# Altium project PCB_Project_Power.PrjPcb (part 1 of 2)
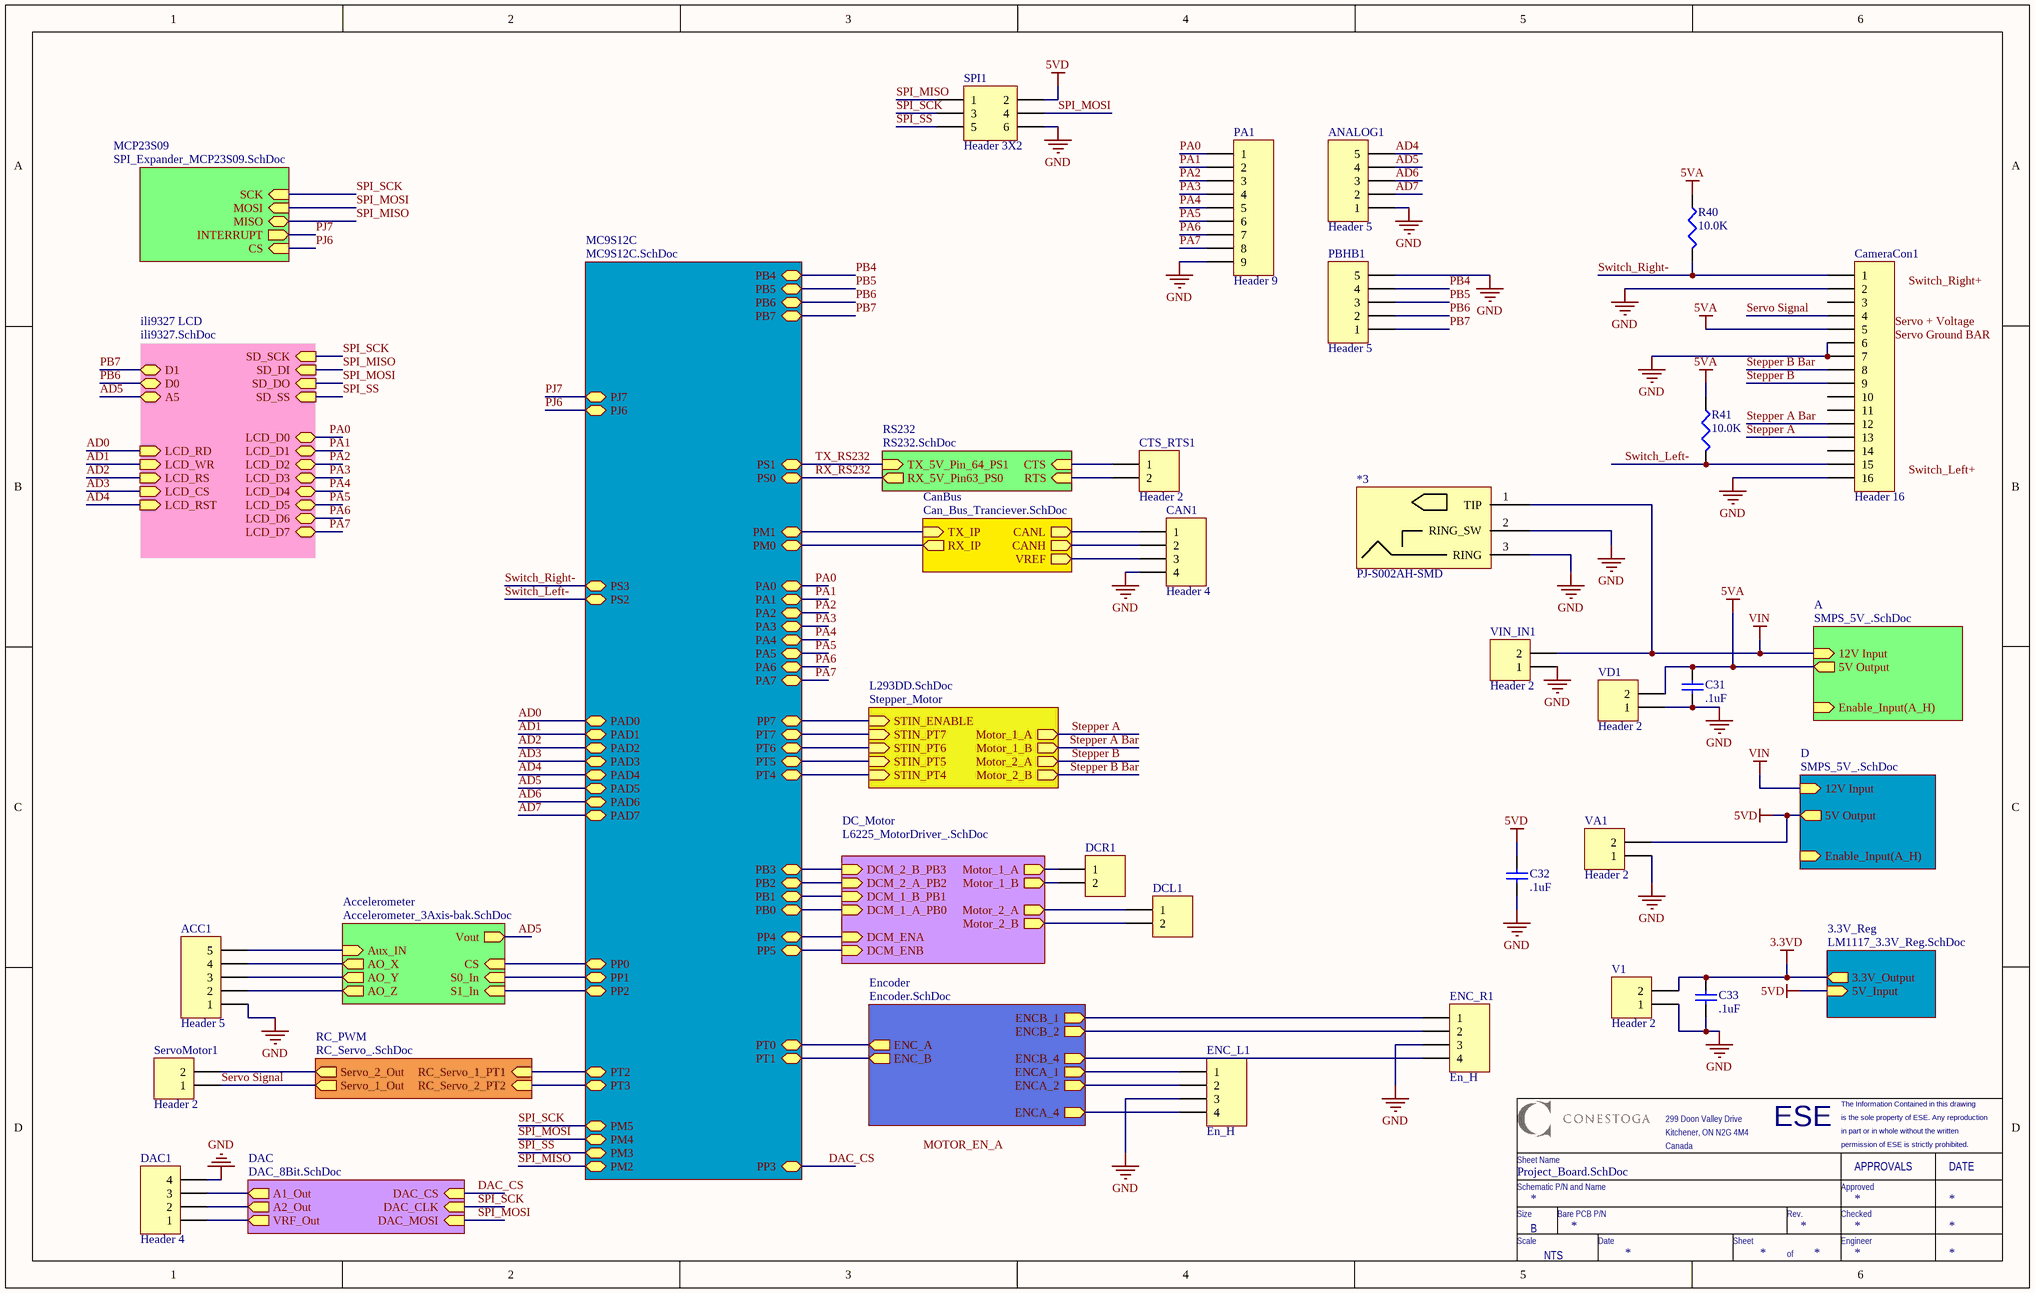
[diagram p0: Project_Board.SchDoc]
15 sheets, 188 parts. Net scope: hierarchical (ports join the sheet entries above them; power ports are global).
Board files: Final_Fantasy.PcbDoc, PCB1.PcbDoc, PCB2.PcbDoc
Sheets:
  Project_Board.SchDoc
    RS232 = RS232.SchDoc
    A = SMPS_5V_.SchDoc
    D = SMPS_5V_.SchDoc
    3.3V_Reg = LM1117_3.3V_Reg.SchDoc
    CanBus = Can_Bus_Tranciever.SchDoc
    DC_Motor = L6225_MotorDriver_.SchDoc
    Stepper_Motor = L293DD.SchDoc
    RC_PWM = RC_Servo_.SchDoc
    Accelerometer = Accelerometer_3Axis-bak.SchDoc
    DAC = DAC_8Bit.SchDoc
    ili9327 LCD = ili9327.SchDoc
    MC9S12C = MC9S12C.SchDoc
    Encoder = Encoder.SchDoc
    MCP23S09 = SPI_Expander_MCP23S09.SchDoc
  PSU.SchDoc

## Sheet Project_Board.SchDoc
size B

### Parts
*3  PJ-S002AH-SMD  [PJ-002AH-SMD]
ACC1  Header 5  [HDR1X5]
ANALOG1  Header 5  [HDR1X5]
C31  value .1uF  [CAPC2012X09M]  (hidden comment: Cap)
C32  value .1uF  [CAPC2012X09M]  (hidden comment: Cap)
C33  value .1uF  [CAPC2012X09M]  (hidden comment: Cap)
CameraCon1  Header 16  [HDR1X16]
CAN1  Header 4  [HDR1X4]
CTS_RTS1  Header 2  [HDR1X2]
DAC1  Header 4  [HDR1X4]
DCL1  Header 2  [HDR1X2]  (value not drawn)
DCR1  Header 2  [HDR1X2]  (value not drawn)
ENC_L1  En_H  [HDR1X4]
ENC_R1  En_H  [HDR1X4]
PA1  Header 9  [HDR1X9]
PBHB1  Header 5  [HDR1X5]
R40  value 10.0K  [RESC2112X05M]  (hidden comment: Res3)
R41  value 10.0K  [RESC2112X05M]  (hidden comment: Res3)
ServoMotor1  Header 2  [HDR1X2]
SPI1  Header 3X2  [HDR2X3]
V1  Header 2  [HDR1X2]
VA1  Header 2  [HDR1X2]
VD1  Header 2  [HDR1X2]
VIN_IN1  Header 2  [HDR1X2]

### Sub-sheets
3.3V_Reg = LM1117_3.3V_Reg.SchDoc: 3.3V_Output (out), 5V_Input (in)
A = SMPS_5V_.SchDoc: 5V Output (out), 12V Input (in), Enable_Input(A_H) (in)
Accelerometer = Accelerometer_3Axis-bak.SchDoc: AO_X (out), AO_Y (out), AO_Z (out), Aux_IN (in), S1_In (in), S0_In (in), CS (in), Vout (out)
CanBus = Can_Bus_Tranciever.SchDoc: TX_IP (in), CANH (out), CANL (out), RX_IP (out), VREF (out)
D = SMPS_5V_.SchDoc: 5V Output (out), 12V Input (in), Enable_Input(A_H) (in)
DAC = DAC_8Bit.SchDoc: A1_Out (out), A2_Out (out), VRF_Out (out), DAC_CS (in), DAC_CLK (in), DAC_MOSI (in)
DC_Motor = L6225_MotorDriver_.SchDoc: Motor_1_A (out), Motor_1_B (out), Motor_2_A (out), Motor_2_B (out), DCM_2_B_PB3 (in), DCM_2_A_PB2 (in), DCM_1_B_PB1 (in), DCM_1_A_PB0 (in), DCM_ENA (in), DCM_ENB (in)
Encoder = Encoder.SchDoc: ENCB_1 (out), ENCB_2 (out), ENCB_4 (out), ENCA_1 (out), ENCA_2 (out), ENCA_4 (out), ENC_A (out), ENC_B (out)
ili9327 LCD = ili9327.SchDoc: SD_SS (in), SD_DI (in), SD_DO (in), SD_SCK (in), LCD_RST (in), LCD_RD (in), LCD_WR (in), LCD_RS (in), LCD_CS (in), LCD_D2, LCD_D3, LCD_D4, LCD_D5, LCD_D6, LCD_D7, LCD_D0, LCD_D1, D1, D0, A5
MC9S12C = MC9S12C.SchDoc: PA0, PA1, PA2, PA3, PA4, PA5, PA6, PA7, PAD0, PAD1, PAD2, PAD3, PAD4, PAD5, PAD6, PAD7, PT0, PT1, PT2, PT3, PT4, PT5, PT6, PT7, PB0, PB1, PB2, PB3, PB4, PB5, PB6, PB7, PM0, PM1, PM2, PM3, PM4, PM5, PS0, PS1, PS2, PS3, PP0, PP1, PP2, PP3, PP4, PP5, PP7, PJ6, PJ7
MCP23S09 = SPI_Expander_MCP23S09.SchDoc: INTERRUPT (out), SCK (in), MOSI (in), MISO, CS (in)
RC_PWM = RC_Servo_.SchDoc: RC_Servo_2_PT2 (in), Servo_2_Out (out), Servo_1_Out (out), RC_Servo_1_PT1 (in)
RS232 = RS232.SchDoc: RTS (in), CTS (in), TX_5V_Pin_64_PS1 (in), RX_5V_Pin63_PS0 (out)
Stepper_Motor = L293DD.SchDoc: STIN_PT4 (in), STIN_PT5 (in), STIN_PT6 (in), STIN_PT7 (in), Motor_1_A (out), Motor_1_B (out), Motor_2_A (out), Motor_2_B (out), STIN_ENABLE (in)

### Nets
3.3VD: C33.2 V1.2 ; sheet 3.3V_Reg/3.3V_Output
5VA: C31.2 CameraCon1.5 R40.1 R41.1 VD1.2 ; sheet A/5V Output
5VD: C32.2 SPI1.2 VA1.2 ; sheet D/5V Output, sheet 3.3V_Reg/5V_Input
GND: *3.2(RING_SW) *3.3(RING) ACC1.1 ANALOG1.1 C31.1 C32.1 C33.1 CameraCon1.2 CameraCon1.6 CameraCon1.7 CameraCon1.16 CAN1.4 DAC1.4 ENC_L1.3 ENC_R1.3 PA1.9 PBHB1.5 SPI1.6 V1.1 VA1.1 VD1.1 VIN_IN1.1
VIN: *3.1(TIP) VIN_IN1.2 ; sheet A/12V Input, sheet D/12V Input
AD0: sheet ili9327 LCD/LCD_RD, sheet MC9S12C/PAD0
AD1: sheet ili9327 LCD/LCD_WR, sheet MC9S12C/PAD1
AD2: sheet ili9327 LCD/LCD_RS, sheet MC9S12C/PAD2
AD3: sheet ili9327 LCD/LCD_CS, sheet MC9S12C/PAD3
AD4: ANALOG1.5 ; sheet ili9327 LCD/LCD_RST, sheet MC9S12C/PAD4
AD5: ANALOG1.4 ; sheet Accelerometer/Vout, sheet ili9327 LCD/A5, sheet MC9S12C/PAD5
AD6: ANALOG1.3 ; sheet MC9S12C/PAD6
AD7: ANALOG1.2 ; sheet MC9S12C/PAD7
DAC_CS: sheet DAC/DAC_CS, sheet MC9S12C/PP3
PA0: PA1.1 ; sheet ili9327 LCD/LCD_D0, sheet MC9S12C/PA0
PA1: PA1.2 ; sheet ili9327 LCD/LCD_D1, sheet MC9S12C/PA1
PA2: PA1.3 ; sheet ili9327 LCD/LCD_D2, sheet MC9S12C/PA2
PA3: PA1.4 ; sheet ili9327 LCD/LCD_D3, sheet MC9S12C/PA3
PA4: PA1.5 ; sheet ili9327 LCD/LCD_D4, sheet MC9S12C/PA4
PA5: PA1.6 ; sheet ili9327 LCD/LCD_D5, sheet MC9S12C/PA5
PA6: PA1.7 ; sheet ili9327 LCD/LCD_D6, sheet MC9S12C/PA6
PA7: PA1.8 ; sheet ili9327 LCD/LCD_D7, sheet MC9S12C/PA7
PB4: PBHB1.4 ; sheet MC9S12C/PB4
PB5: PBHB1.3 ; sheet MC9S12C/PB5
PB6: PBHB1.2 ; sheet ili9327 LCD/D0, sheet MC9S12C/PB6
PB7: PBHB1.1 ; sheet ili9327 LCD/D1, sheet MC9S12C/PB7
PJ6: sheet MC9S12C/PJ6, sheet MCP23S09/CS
PJ7: sheet MC9S12C/PJ7, sheet MCP23S09/INTERRUPT
RX_RS232: sheet RS232/RX_5V_Pin63_PS0, sheet MC9S12C/PS0
Servo Signal: CameraCon1.4 ServoMotor1.1 ; sheet RC_PWM/Servo_1_Out
SPI_MISO: SPI1.1 ; sheet ili9327 LCD/SD_DI, sheet MC9S12C/PM2, sheet MCP23S09/MISO
SPI_MOSI: SPI1.4 ; sheet DAC/DAC_MOSI, sheet ili9327 LCD/SD_DO, sheet MC9S12C/PM4, sheet MCP23S09/MOSI
SPI_SCK: SPI1.3 ; sheet DAC/DAC_CLK, sheet ili9327 LCD/SD_SCK, sheet MC9S12C/PM5, sheet MCP23S09/SCK
SPI_SS: SPI1.5 ; sheet ili9327 LCD/SD_SS, sheet MC9S12C/PM3
Stepper A: CameraCon1.13 ; sheet Stepper_Motor/Motor_1_A
Stepper A Bar: CameraCon1.12 ; sheet Stepper_Motor/Motor_1_B
Stepper B: CameraCon1.9 ; sheet Stepper_Motor/Motor_2_A
Stepper B Bar: CameraCon1.8 ; sheet Stepper_Motor/Motor_2_B
Switch_Left-: CameraCon1.15 R41.2 ; sheet MC9S12C/PS2
Switch_Right-: CameraCon1.1 R40.2 ; sheet MC9S12C/PS3
TX_RS232: sheet RS232/TX_5V_Pin_64_PS1, sheet MC9S12C/PS1
NetACC1_2: ACC1.2 ; sheet Accelerometer/AO_Z
NetACC1_3: ACC1.3 ; sheet Accelerometer/AO_Y
NetACC1_4: ACC1.4 ; sheet Accelerometer/AO_X
NetACC1_5: ACC1.5 ; sheet Accelerometer/Aux_IN
NetC48_2: ENC_L1.1 ; sheet Encoder/ENCA_1
NetC49_2: ENC_R1.1 ; sheet Encoder/ENCB_1
NetC50_1: ENC_L1.4 ; sheet Encoder/ENCA_4
NetC51_1: ENC_R1.4 ; sheet Encoder/ENCB_4
NetCAN1_1: CAN1.1 ; sheet CanBus/CANL
NetCAN1_2: CAN1.2 ; sheet CanBus/CANH
NetCAN1_3: CAN1.3 ; sheet CanBus/VREF
NetCan_Bus1_1: sheet CanBus/TX_IP, sheet MC9S12C/PM1
NetCan_Bus1_4: sheet CanBus/RX_IP, sheet MC9S12C/PM0
NetCTS_RTS1_1: CTS_RTS1.1 ; sheet RS232/CTS
NetCTS_RTS1_2: CTS_RTS1.2 ; sheet RS232/RTS
NetDAC1_1: DAC1.1 ; sheet DAC/VRF_Out
NetDAC1_2: DAC1.2 ; sheet DAC/A2_Out
NetDAC1_3: DAC1.3 ; sheet DAC/A1_Out
NetDCL1_1: DCL1.1 ; sheet DC_Motor/Motor_2_A
NetDCL1_2: DCL1.2 ; sheet DC_Motor/Motor_2_B
NetDCR1_1: DCR1.1 ; sheet DC_Motor/Motor_1_A
NetDCR1_2: DCR1.2 ; sheet DC_Motor/Motor_1_B
NetENC_L1_2: ENC_L1.2 ; sheet Encoder/ENCA_2
NetENC_R1_2: ENC_R1.2 ; sheet Encoder/ENCB_2
NetFreescale_Processor1_2: sheet Accelerometer/S1_In, sheet MC9S12C/PP2
NetFreescale_Processor1_3: sheet Accelerometer/S0_In, sheet MC9S12C/PP1
NetFreescale_Processor1_4: sheet Accelerometer/CS, sheet MC9S12C/PP0
NetFreescale_Processor1_5: sheet MC9S12C/PT0, sheet Encoder/ENC_A
NetFreescale_Processor1_6: sheet MC9S12C/PT1, sheet Encoder/ENC_B
NetFreescale_Processor1_7: sheet RC_PWM/RC_Servo_1_PT1, sheet MC9S12C/PT2
NetFreescale_Processor1_8: sheet RC_PWM/RC_Servo_2_PT2, sheet MC9S12C/PT3
NetFreescale_Processor1_11: sheet Stepper_Motor/STIN_PT4, sheet MC9S12C/PT4
NetFreescale_Processor1_12: sheet Stepper_Motor/STIN_PT5, sheet MC9S12C/PT5
NetFreescale_Processor1_13: sheet Stepper_Motor/STIN_PT6, sheet MC9S12C/PT6
NetFreescale_Processor1_14: sheet Stepper_Motor/STIN_PT7, sheet MC9S12C/PT7
NetFreescale_Processor1_16: sheet DC_Motor/DCM_1_A_PB0, sheet MC9S12C/PB0
NetFreescale_Processor1_17: sheet DC_Motor/DCM_1_B_PB1, sheet MC9S12C/PB1
NetFreescale_Processor1_18: sheet DC_Motor/DCM_2_A_PB2, sheet MC9S12C/PB2
NetFreescale_Processor1_19: sheet DC_Motor/DCM_2_B_PB3, sheet MC9S12C/PB3
NetFreescale_Processor1_78: sheet Stepper_Motor/STIN_ENABLE, sheet MC9S12C/PP7
NetFreescale_Processor1_79: sheet DC_Motor/DCM_ENB, sheet MC9S12C/PP5
NetFreescale_Processor1_80: sheet DC_Motor/DCM_ENA, sheet MC9S12C/PP4
NetR50_2: ServoMotor1.2 ; sheet RC_PWM/Servo_2_Out

Not connected (* = marked no-connect by the designer): CameraCon1 3 10 11 14

### Notes on the sheet
- Labels drawn without touching a wire or pin: MOTOR_EN_A, Servo + Voltage, Servo Ground BAR, Switch_Left+, Switch_Right+
- ESE
- is the sole property of ESE. Any reproduction
- The Information Contained in this drawing
- Schematic P/N and Name
- Sheet Name
- 299 Doon Valley Drive
- Kitchener, ON N2G 4M4
- Canada
- Approved
- in part or in whole without the written
- permission of ESE is strictly prohibited.
- APPROVALS
- DATE
- Size
- Scale
- B
- NTS
- Bare PCB P/N
- Date
- Sheet
- Rev.
- Checked
- Engineer
- of

### Library data of the parts
ACC1 ANALOG1 PBHB1 = Header 5: Header, 5-Pin; LatestRevisionDate: 17-Jul-2002; LatestRevisionNote: Re-released for DXP Platform.; Publisher: Altium Limited
C31-C33 = CAP-Z5U-.1uF-50V-±20%: CAP CER .1uF 50v Z5U 0805; MPN: C0805C104M5UACTU; WV: 50; Tolerance: ±20%; PN: 399-1176-1-ND; Name: CAP-Z5U-.1uF-50V-±20%; Type: Z5U; URL: http://www.digikey.ca/product-detail/en/C0805C104M5UACTU/399-1176-1-ND
CameraCon1 = Header 16: Header, 16-Pin; LatestRevisionDate: 17-Jul-2002; LatestRevisionNote: Re-released for DXP Platform.; Publisher: Altium Limited
CAN1 DAC1 ENC_L1 ENC_R1 = Header 4: Header, 4-Pin; LatestRevisionDate: 17-Jul-2002; LatestRevisionNote: Re-released for DXP Platform.; Publisher: Altium Limited
CTS_RTS1 ServoMotor1 V1 VA1 VD1 VIN_IN1 = Header 2: Header, 2-Pin; PN: S1212E-02-ND; URL: http://www.digikey.ca/product-detail/en/PEC04SFAN/S1212E-02-ND
DCL1 DCR1 = Header 2: Header, 2-Pin; MPN: PEC02SFAN; PN: S1212E-02-ND; URL: http://www.digikey.ca/product-detail/en/PEC04SFAN/S1212E-02-ND
PA1 = Header 9: Header, 9-Pin; LatestRevisionDate: 17-Jul-2002; LatestRevisionNote: Re-released for DXP Platform.; Publisher: Altium Limited
R40 R41 = Resistor_10.0K: RES SMD 10.0K OHM 1% 1/8W 0805; MPN: CRCW080510K0FKEA; PN: 541-10.0KCCT-ND; Name: Resistor_10.0K; URL: http://www.digikey.ca/product-detail/en/CRCW080510K0FKEA/541-10.0KCCT-ND
SPI1 = Header 3X2: Header, 3-Pin, Dual row; LatestRevisionDate: 17-Jul-2002; LatestRevisionNote: Re-released for DXP Platform.; Publisher: Altium Limited
*3 = PJ-S002AH-SMD: URL: http://www.digikey.com/product-detail/en/PJ-002AH-SMT-TR/CP-002AHPJCT-ND/669692

## Sheet RS232.SchDoc
size B
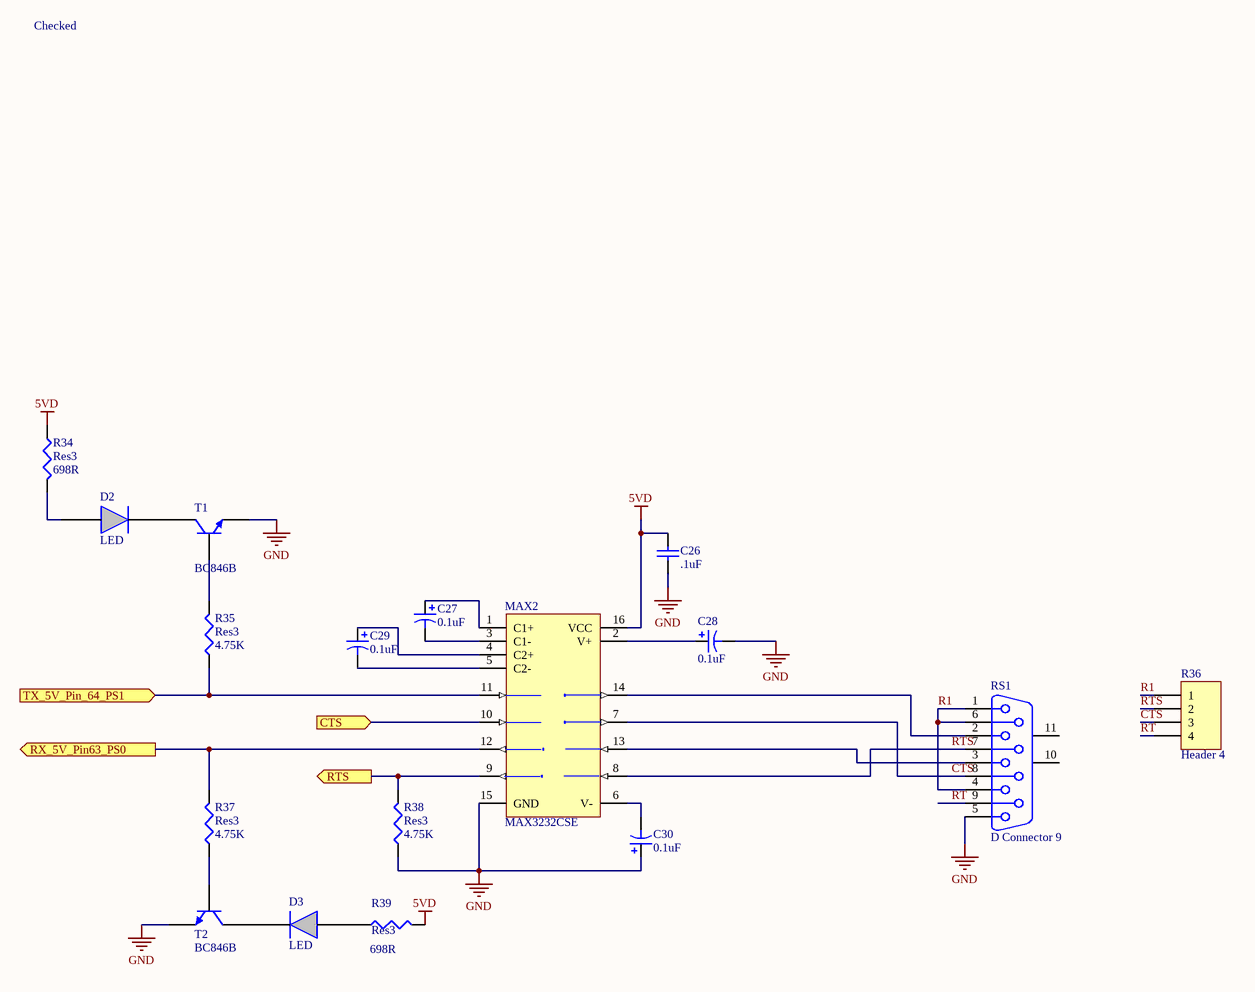
[diagram p1: RS232.SchDoc]

### Parts
C26  value .1uF  [CAPC2012X09M]  (hidden comment: Cap)
C27  value 0.1uF  [CAPACITOR_3MM]  (hidden comment: Pol)
C28  value 0.1uF  [CAPACITOR_3MM]  (hidden comment: Pol)
C29  value 0.1uF  [CAPACITOR_3MM]  (hidden comment: Pol)
C30  value 0.1uF  [CAPACITOR_3MM]  (hidden comment: Pol)
D2  LED  [LED]
D3  LED  [LED]
MAX2  MAX3232CSE  [NSO16_N]
R34  Res3  value 698R  [RESC2112X05M]
R35  Res3  value 4.75K  [RESC2112X05M]
R36  Header 4  [HDR1X4]
R37  Res3  value 4.75K  [RESC2112X05M]
R38  Res3  value 4.75K  [RESC2112X05M]
R39  Res3  value 698R  [RESC2112X05M]
RS1  D Connector 9  [DSUB1.385-2H9]
T1  BC846B  [SOT95P230X110-3M]
T2  BC846B  [SOT95P230X110-3M]

### Ports
CTS (in), RTS (out), RX_5V_Pin63_PS0 (out), TX_5V_Pin_64_PS1 (in)

### Nets
5VD: C26.1 MAX2.16(VCC) R34.1 R39.2
GND: C26.2 C28.2 C30.1 MAX2.15(GND) R38.1 RS1.5 T1.2(E) T2.2(E)
CTS: MAX2.7(T2OUT) R36.3 RS1.8
R1: R36.1 RS1.1 RS1.4 RS1.6
RT: R36.4 RS1.9
RTS: MAX2.8(R2IN) R36.2 RS1.7
RX_RS232: MAX2.12(R1OUT) R37.2 ; port RX_5V_Pin63_PS0
TX_RS232: MAX2.11(T1IN) R35.1 ; port TX_5V_Pin_64_PS1
NetC27_1: C27.1 MAX2.1(C1+)
NetC27_2: C27.2 MAX2.3(C1-)
NetC28_1: C28.1 MAX2.2(V+)
NetC29_1: C29.1 MAX2.4(C2+)
NetC29_2: C29.2 MAX2.5(C2-)
NetC30_2: C30.2 MAX2.6(V-)
NetCTS_RTS1_1: MAX2.10(T2IN) ; port CTS
NetCTS_RTS1_2: MAX2.9(R2OUT) R38.2 ; port RTS
NetD2_1: D2.1 T1.3(C)
NetD2_2: D2.2 R34.2
NetD3_1: D3.1 T2.3(C)
NetD3_2: D3.2 R39.1
NetMAX2_13: MAX2.13(R1IN) RS1.3
NetMAX2_14: MAX2.14(T1OUT) RS1.2
NetR35_2: R35.2 T1.1(B)
NetR37_1: R37.1 T2.1(B)

Not connected (* = marked no-connect by the designer): RS1 10(MH1) 11(MH2)

### Notes on the sheet
- Checked
- ESE
- is the sole property of ESE. Any reproduction
- The Information Contained in this drawing
- Schematic P/N and Name
- Sheet Name
- 299 Doon Valley Drive
- Kitchener, ON N2G 4M4
- Canada
- Approved
- in part or in whole without the written
- permission of ESE is strictly prohibited.
- APPROVALS
- DATE
- Size
- Scale
- B
- NTS
- Bare PCB P/N
- Date
- Sheet
- Rev.
- Engineer
- of

### Library data of the parts
C26 = CAP-X7R-.1uF-50V-±20%: CAP CER .1uF 50v X7R 0805; MPN: C0805C104M5RACTU; WV: 50; Tolerance: ±20%; PN: 399-1169-1-ND; Name: CAP-X7R-.1uF-50V-±20%; Type: X7R; URL: http://www.digikey.ca/product-detail/en/C0805C104M5RACTU/399-1169-1-ND
C27-C30 = Cap Polar-0.1uF-50V: CAP 85C 0.1uF ±20% 50V WX Series Aluminum Electrolytic; MPN: UWX1H0R1MCL2GB; Tan Theta: 0.12; Leakage Current: 3; Rated Ripple Current: 1; PN: 493-2121-1-ND; Name: Cap Polar-0.1uF-50V; Diameter: 3; URL: http://www.digikey.ca/product-detail/en/UWX1H0R1MCL2GB/493-2121-1-ND
MAX2 = MAX3232CSE: 3.0V TO 5.5V, Low-Power, up to 1Mbps, True RS-232 Transceiver Using Four 0.1µF External Capacitor; PN: MAX3232CSE+-ND; Published: 16-Jan-2001; LatestRevisionDate: 13-Apr-2006; LatestRevisionNote: IPC-7351 Footprint Added.; DatasheetVersion: Mar-1999; PackageReference: NSO16; Publisher: Altium Limited; PackageDescription: 16-Pin Small Outline Integrated Circuit 1.27 mm Pitch; Code_JEDEC: MS-012-AC; Code_IPC: SOIC127P600-16; ComponentLink1Description: Manufacturer Link; ComponentLink1URL: http://www.maxim-ic.com/; ComponentLink2Description: Datasheet; ComponentLink2URL: http://pdfserv.maxim-ic.com/en/ds/MAX3222-MAX3241.pdf; URL: http://www.digikey.ca/product-detail/en/MAX3232CSE%2B/MAX3232CSE%2B-ND/947902
R34 R39 = Resistor_698R: RES SMD 698R OHM 1% 1/8W 0805; MPN: CRCW0805698RFKEA; PN: 541-698CCT-ND; Name: Resistor_698R; URL: http://www.digikey.ca/product-detail/en/CRCW0805698RFKEA/541-698CCT-ND
R35 R37 R38 = Resistor_4.75K: RES SMD 4.75K OHM 1% 1/8W 0805; MPN: CRCW08054K75FKEA; PN: 541-4750KCCT-ND; Name: Resistor_4.75K; URL: http://www.digikey.ca/product-detail/en/CRCW08054K75FKEA/541-4750KCCT-ND
R36 = Header 4: Header, 4-Pin Male; MPN: PEC04SFAN; PN: S1212E-04-ND; URL: http://www.digikey.ca/product-detail/en/PEC04SFAN/S1212E-04-ND
RS1 = D Connector 9: Receptacle Assembly, 9 Position, Right Angle; PN: AE10921-ND; URL: http://www.digikey.ca/product-detail/en/ADF09A-KG-TASB3-R/AE10921-ND/1241800
T1 T2 = BC846B: NPN General Purpose Amplifier; PN: 568-1632-1-ND; URL: http://www.digikey.ca/product-detail/en/BC846B,215/568-1632-1-ND/763459

## Sheet SMPS_5V_.SchDoc
size B
Used 2 times, as channels A, D. Parts and nets are listed once, with the designators drawn on the sheet.
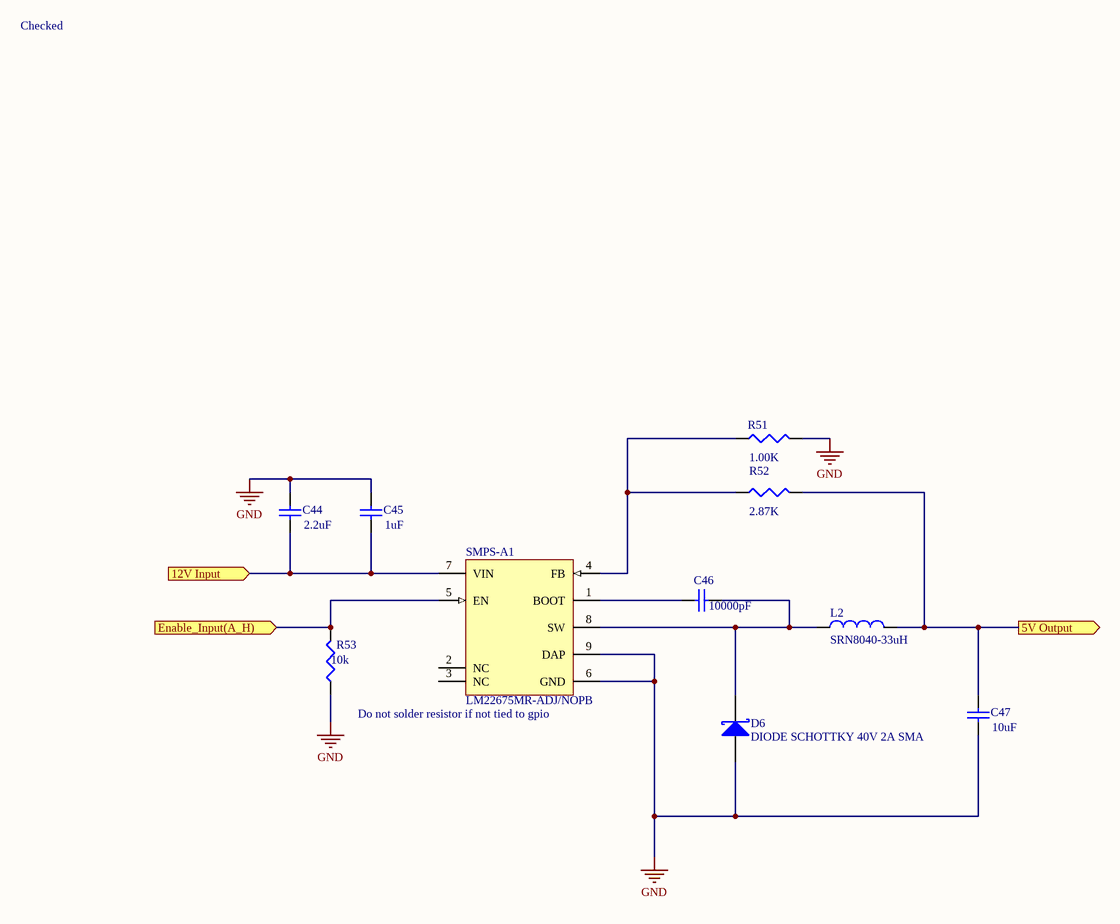
[diagram p2: SMPS_5V_.SchDoc]

### Parts
C44  value 2.2uF  [C1210]  (hidden comment: Cap-100V)
C45  value 1uF  [CAPC2012X09M]  (hidden comment: Cap)
C46  value 10000pF  [CAPC2012X09M]  (hidden comment: Cap)
C47  value 10uF  [C1210]  (hidden comment: Cap-10v-A)
D6  DIODE SCHOTTKY 40V 2A SMA  [DIOM4326X23M]
L2  SRN8040-33uH  [INDP8080X40M]
R51  value 1.00K  [RESC2112X05M]  (hidden comment: RFb1)
R52  value 2.87K  [RESC2112X05M]  (hidden comment: Res3)
R53  value 10k  [RESC2112X05M]  (hidden comment: Res3)
SMPS-A1  LM22675MR-ADJ/NOPB  [MRA08B_L]

### Ports
5V Output (out), 12V Input (in), Enable_Input(A_H) (in)

### Nets
GND: C44.2 C45.2 C47.1 D6.2(A) R51.2 R53.1 SMPS-A1.6(GND) SMPS-A1.9(DAP)
5V Output: C47.2 L2.2 R52.2 ; port 5V Output
12V Input: C44.1 C45.1 SMPS-A1.7(VIN) ; port 12V Input
Enable_Input(A_H): R53.2 SMPS-A1.5(EN) ; port Enable_Input(A_H)
NetC46_1: C46.1 D6.1(K) L2.1 SMPS-A1.8(SW)
NetC46_2: C46.2 SMPS-A1.1(BOOT)
NetR51_1: R51.1 R52.1 SMPS-A1.4(FB)

Not connected (* = marked no-connect by the designer): SMPS-A1 2(NC) 3(NC)

### Channels
A: designators end in _A; ports 5V Output=5VA 12V Input=VIN Enable_Input(A_H)=NetR53_A_2
D: designators end in _D; ports 5V Output=5VD 12V Input=VIN Enable_Input(A_H)=NetR53_D_2

### Notes on the sheet
- Checked
- Do not solder resistor if not tied to gpio
- ESE
- is the sole property of ESE. Any reproduction
- The Information Contained in this drawing
- Schematic P/N and Name
- Sheet Name
- 299 Doon Valley Drive
- Kitchener, ON N2G 4M4
- Canada
- Approved
- in part or in whole without the written
- permission of ESE is strictly prohibited.
- APPROVALS
- DATE
- Size
- Scale
- B
- NTS
- Bare PCB P/N
- Date
- Sheet
- Rev.
- Engineer
- of

### Library data of the parts
C44 C47 = Cap: Capacitor; Published: 8-Jun-2000; LatestRevisionDate: 17-Jul-2002; LatestRevisionNote: Re-released for DXP Platform.; PackageReference: RAD-0.3; Publisher: Altium Limited; PackageDescription: Radial Cap, Thru-Hole; 2 Leads; 0.3 in Pin Spacing
  C44: URL: http://www.digikey.ca/product-detail/en/HMK325B7225KN-T/587-1778-2-ND/1212778
C45 = CAP-X7R-1uF-16V-±10%: CAP CER 1uF 16v X7R 0805; MPN: C0805C105K4RACTU; WV: 16; Tolerance: ±10%; PN: 399-1284-1-ND; Name: CAP-X7R-1uF-16V-±10%; Type: X7R; URL: http://www.digikey.ca/product-detail/en/C0805C105K4RACTU/399-1284-1-ND
C46 = CAP-X7R-10000pF-100V-±10%: CAP CER 10000pF 100v X7R 0805; MPN: C0805C103K1RACTU; WV: 100; Tolerance: ±10%; PN: 399-1159-1-ND; Name: CAP-X7R-10000pF-100V-±10%; Type: X7R; URL: http://www.digikey.ca/product-detail/en/C0805C103K1RACTU/399-1159-1-ND
D6 = DIODE SCHOTTKY 40V 2A SMA: Schottky Rectifier; MPN: B240A-13-F; PN: B240A-FDICT-ND; URL: http://www.digikey.ca/product-detail/en/B240A-13-F/B240A-FDICT-ND
L2 = SRN8040: FIXED IND 22UH 2.2A 100 MOHM SMD; MPN: SRN8040-220M; PN: SRN8040-220MCT-ND; URL: http://www.digikey.ca/product-detail/en/SRN8040-330M/SRN8040-330MCT-ND/2756183
R51 = Resistor_1.00K: RES SMD 1.00K OHM 1% 1/8W 0805; MPN: CRCW08051K00FKEA; PN: 541-1000KCCT-ND; Name: Resistor_1.00K; URL: http://www.digikey.ca/product-detail/en/CRCW08051K00FKEA/541-1000KCCT-ND
R52 R53 = Resistor_2.87K: RES SMD 2.87K OHM 1% 1/8W 0805; MPN: CRCW08052K87FKEA; PN: 541-2870KCCT-ND; Name: Resistor_2.87K; URL: http://www.digikey.ca/product-detail/en/CRCW08052K87FKEA/541-2870KCCT-ND
SMPS-A1 = LM22675MR-ADJ/NOPB: 1A SIMPLE SWITCHER®, Step-Down Voltage Regulator with Precision Enable, 8-pin PSOP, Pb-Free; Manufacturer: National Semiconductor; MPN: LM22675MRE-ADJ/NOPB; PackageTopMarking: NSXYTT*L22675*ADJ; PowerWise: N; High-Reliability: Y; PN: LM22675MRE-ADJ/NOPBCT-ND; DatasheetVersion: Dec-2010; PackageVersion: revB, Dec-2007; PackageReference: MRA08B; PackageDescription: Molded, PSOP .193 x .154 x .058in, 8 Lead, .050in Pitch, Large DAP; PartNumber: LM22675MR-ADJ/NOPB; RoHS: Y; PinCount: 8; CompType: Switcher; Code_JEDEC: MS-012-AA; ComponentLink1Description: Manufacturer URL; ComponentLink1URL: http://www.national.com/; ComponentLink2Description: LM22675 Datasheet; ComponentLink2URL: http://www.national.com/ds/LM/LM22675.pdf; ComponentLink3Description: LM22675 Web Page; ComponentLink3URL: http://www.national.com/pf/LM/LM22675.html; ComponentLink4Description: MRA08B Package Page; ComponentLink4URL: http://www.national.com/packaging/folders/mra08b.html; URL: http://www.digikey.ca/product-detail/en/LM22675MRE-ADJ%2FNOPB/LM22675MRE-ADJ%2FNOPBCT-ND

## Sheet LM1117_3.3V_Reg.SchDoc
size B
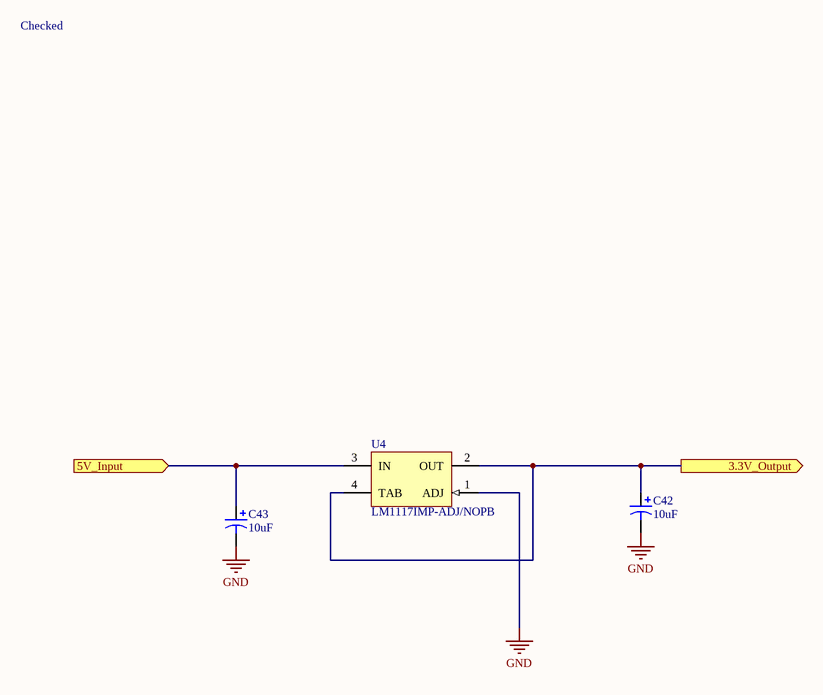
[diagram p3: LM1117_3.3V_Reg.SchDoc]

### Parts
C42  value 10uF  [CAPACITOR_3MM]  (hidden comment: Pol)
C43  value 10uF  [CAPACITOR_3MM]  (hidden comment: Pol)
U4  LM1117IMP-ADJ/NOPB  [MP04A_L]

### Ports
3.3V_Output (out), 5V_Input (in)

### Nets
3.3VD: C42.1 U4.2(OUT) U4.4(TAB) ; port 3.3V_Output
5VD: C43.1 U4.3(IN) ; port 5V_Input
GND: C42.2 C43.2 U4.1(ADJ)

### Notes on the sheet
- Checked
- ESE
- is the sole property of ESE. Any reproduction
- The Information Contained in this drawing
- Schematic P/N and Name
- Sheet Name
- 299 Doon Valley Drive
- Kitchener, ON N2G 4M4
- Canada
- Approved
- in part or in whole without the written
- permission of ESE is strictly prohibited.
- APPROVALS
- DATE
- Size
- Scale
- B
- NTS
- Bare PCB P/N
- Date
- Sheet
- Rev.
- Engineer
- of

### Library data of the parts
C42 C43 = Cap Polar-0.1uF-50V: as C27 on sheet RS232; Name: Cap Polar-0.1uF-50V; Diameter: 3; URL: http://www.digikey.ca/product-detail/en/UWX1C100MCL2GB/493-2099-2-ND/589840
U4 = LM1117IMP-ADJ/NOPB: 800mA Low-Dropout Linear Regulator, 4-pin SOT-223, Pb-Free; Manufacturer: National Semiconductor; MPN: LM1117MP-3.3/NOPB; PackageTopMarking: XYTT*N03B; PowerWise: N; CompType: LDO IC; PN: LM1117MP-3.3/NOPBCT-ND; Published: 1-Mar-2010; DatasheetVersion: Apr-2006; PackageVersion: revB, Apr-2003; PackageReference: MP04A; Publisher: Altium Limited; PackageDescription: Molded SOT-223, 6.50 x 3.56 x 1.6mm Body, 4 Lead, 2.3mm Pitch; Supplier 1: Digi-Key; Supplier Part Number 1: LM1117IMP-ADJTR-ND; Supplier 2: Digi-Key; Supplier Part Number 2: LM1117IMP-ADJCT-ND; Supplier 3: Digi-Key; Supplier Part Number 3: LM1117IMP-ADJDKR-ND; Supplier 4: Farnell; Supplier Part Number 4: 1469050; PartNumber: LM1117IMP-ADJ/NOPB; RoHS: Y; PinCount: 4; Code_JEDEC: TO-261-AA; Code_IPC: SOT223-4; ComponentLink1Description: LM1117 Datasheet; ComponentLink1URL: http://www.national.com/ds/LM/LM1117.pdf; ComponentLink2Description: LM1117 Web Page; ComponentLink2URL: http://www.national.com/pf/LM/LM1117.html; ComponentLink3Description: MP04A Package Page; ComponentLink3URL: http://www.national.com/packaging/folders/mp04a.html; URL: http://www.digikey.ca/product-detail/en/LM1117MP-3.3%2FNOPB/LM1117MP-3.3%2FNOPBCT-ND

## Sheet Can_Bus_Tranciever.SchDoc
size B
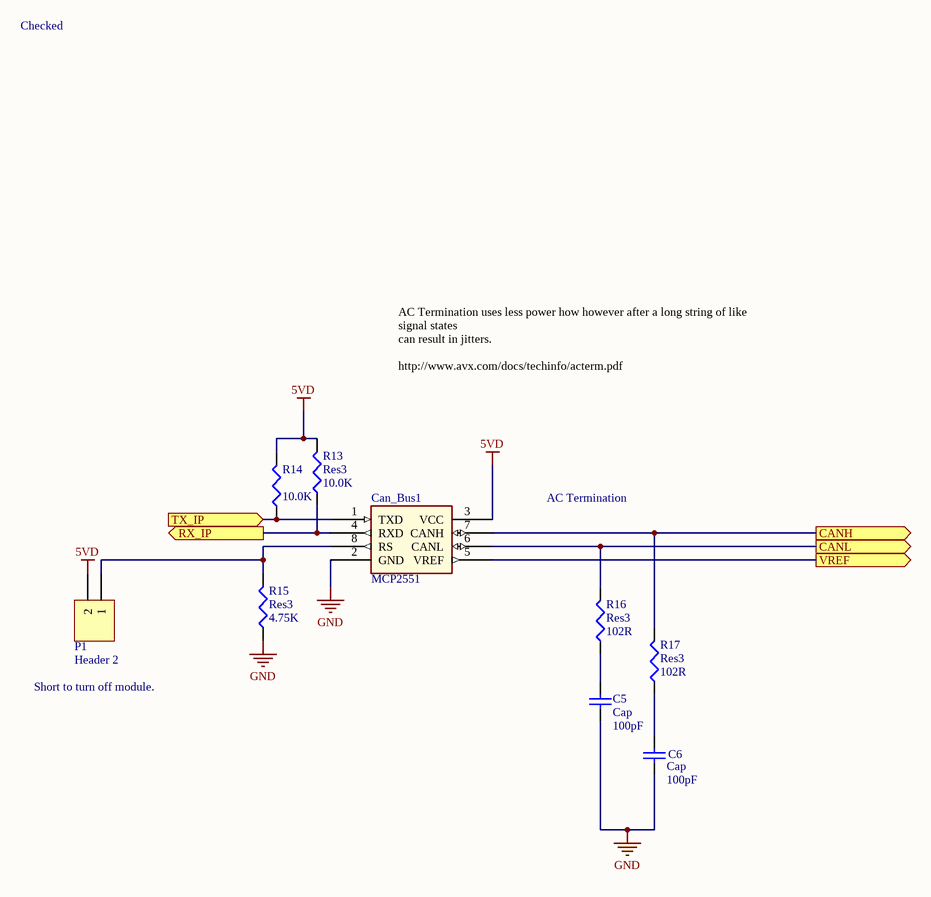
[diagram p4: Can_Bus_Tranciever.SchDoc]

### Parts
C5  Cap  value 100pF  [CAPC2012X09M]
C6  Cap  value 100pF  [CAPC2012X09M]
Can_Bus1  MCP2551  [SOIC127P600X175-8M]
P1  Header 2  [HDR1X2]
R13  Res3  value 10.0K  [RESC2112X05M]
R14  value 10.0K  [RESC2112X05M]  (hidden comment: Res3)
R15  Res3  value 4.75K  [RESC2112X05M]
R16  Res3  value 102R  [RESC2112X05M]
R17  Res3  value 102R  [RESC2112X05M]

### Ports
CANH (out), CANL (out), RX_IP (out), TX_IP (in), VREF (out)

### Nets
5VD: Can_Bus1.3(VCC) P1.2 R13.2 R14.2
GND: C5.1 C6.1 Can_Bus1.2(GND) R15.1
NetC5_2: C5.2 R16.1
NetC6_2: C6.2 R17.1
NetCAN1_1: Can_Bus1.6(CANL) R16.2 ; port CANL
NetCAN1_2: Can_Bus1.7(CANH) R17.2 ; port CANH
NetCAN1_3: Can_Bus1.5(VREF) ; port VREF
NetCan_Bus1_1: Can_Bus1.1(TXD) R14.1 ; port TX_IP
NetCan_Bus1_4: Can_Bus1.4(RXD) R13.1 ; port RX_IP
NetCan_Bus1_8: Can_Bus1.8(RS) P1.1 R15.2

### Notes on the sheet
- Checked
- AC Termination uses less power how however after a long string of like signal states
  can result in jitters.
  http://www.avx.com/docs/techinfo/acterm.pdf
- AC Termination
- Short to turn off module.
- ESE
- is the sole property of ESE. Any reproduction
- The Information Contained in this drawing
- Schematic P/N and Name
- Sheet Name
- 299 Doon Valley Drive
- Kitchener, ON N2G 4M4
- Canada
- Approved
- in part or in whole without the written
- permission of ESE is strictly prohibited.
- APPROVALS
- DATE
- Size
- Scale
- B
- NTS
- Bare PCB P/N
- Date
- Sheet
- Rev.
- Engineer
- of

### Library data of the parts
C5 C6 = CAP-COG-100pF-500V-±5%: CAP CER 100pF 500v COG 0805; MPN: C0805C101JCGACTU; PN: 399-5102-1-ND; Name: CAP-COG-100pF-500V-±5%; URL: http://www.digikey.ca/product-detail/en/C0805C101JCGACTU/399-5102-1-ND
Can_Bus1 = MCP2551: IC TRANSCEIVER CAN HI-SPD 8-SOIC; MPN: MCP2551T-E/SN; PN: MCP2551T-E/SNCT-ND; URL: http://ww1.microchip.com/downloads/en/DeviceDoc/21667f.pdf
P1 = Header 2: Header, 2-Pin Male; MPN: PEC02SFAN; PN: S1212E-02-ND; URL: http://www.digikey.ca/product-detail/en/PEC04SFAN/S1212E-02-ND
R13 R14 = Resistor_10.0K: as R40 on sheet Project_Board; Name: Resistor_10.0K; URL: http://www.digikey.ca/product-detail/en/CRCW080510K0FKEA/541-10.0KCCT-ND
R15 = Resistor_4.75K: RES SMD 4.75K OHM 1% 1/8W 0805; MPN: CRCW08054K75FKEA; PN: 541-4.75KCCT-ND; Name: Resistor_4.75K; URL: http://www.digikey.ca/product-detail/en/CRCW08054K75FKEA/541-4.75KCCT-ND
R16 R17 = Resistor_102R: RES SMD 102R OHM 1% 1/8W 0805; MPN: CRCW0805102RFKEA; PN: 541-102CCT-ND; Name: Resistor_102R; URL: http://www.digikey.ca/product-detail/en/CRCW0805102RFKEA/541-102CCT-ND

## Sheet L6225_MotorDriver_.SchDoc
size B
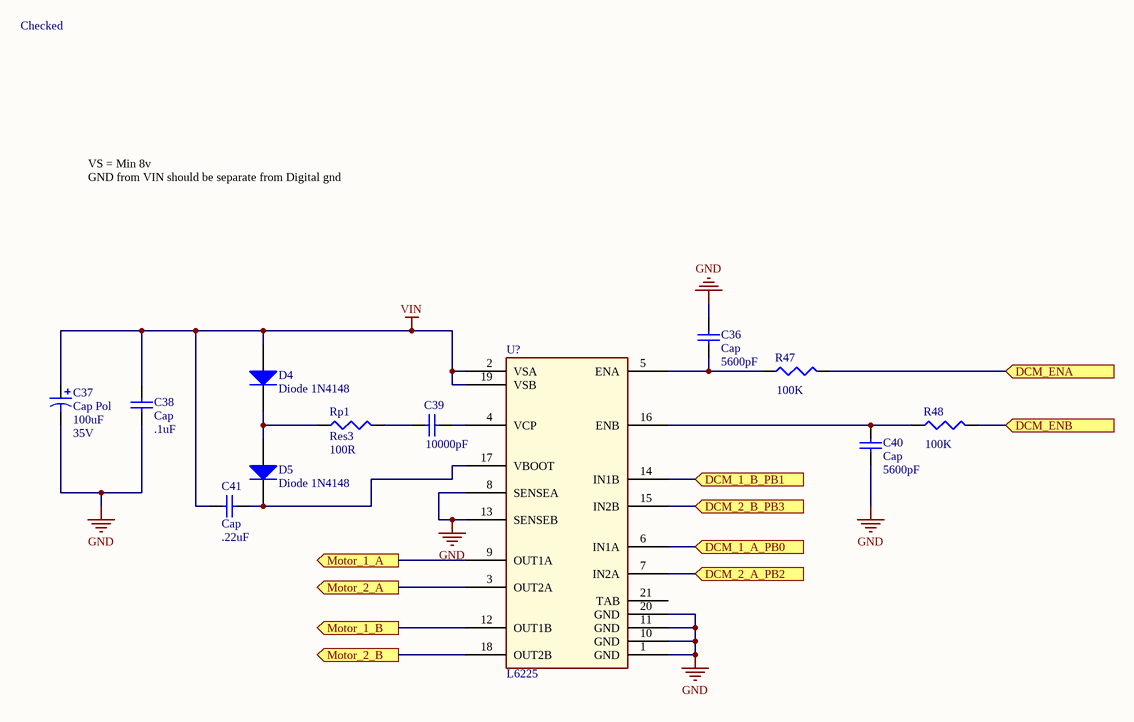
[diagram p5: L6225_MotorDriver_.SchDoc]

### Parts
C36  Cap  value 5600pF  [CAPC2012X09M]
C37  Cap Pol  value 100uF  Voltage: 35V  [CAPACITOR_6.3MM]
C38  Cap  value .1uF  [CAPC2012X09M]
C39  value 10000pF  [CAPC2012X09M]  (hidden comment: Cap)
C40  Cap  value 5600pF  [CAPC2012X09M]
C41  Cap  value .22uF  [CAPC2012X09M]
D4  Diode 1N4148  [zener_sod323]
D5  Diode 1N4148  [zener_sod323]
R47  value 100K  [RESC2112X05M]  (hidden comment: Res3)
R48  value 100K  [RESC2112X05M]  (hidden comment: Res3)
Rp1  Res3  value 100R  [RESC2112X05M]
U?  L6225  [POWERSOP20]

### Ports
DCM_1_A_PB0 (in), DCM_1_B_PB1 (in), DCM_2_A_PB2 (in), DCM_2_B_PB3 (in), DCM_ENA (in), DCM_ENB (in), Motor_1_A (out), Motor_1_B (out), Motor_2_A (out), Motor_2_B (out)

### Nets
GND: C36.2 C37.2 C38.1 C40.1 U?.1(GND) U?.8(SENSEA) U?.10(GND) U?.11(GND) U?.13(SENSEB) U?.20(GND)
VIN: C37.1 C38.2 C41.1 D4.A U?.2(VSA) U?.19(VSB)
NetC36_1: C36.1 R47.1 U?.5(ENA)
NetC39_1: C39.1 Rp1.2
NetC39_2: C39.2 U?.4(VCP)
NetC40_2: C40.2 R48.1 U?.16(ENB)
NetC41_2: C41.2 D5.K U?.17(VBOOT)
NetD4_K: D4.K D5.A Rp1.1
NetDCL1_1: U?.3(OUT2A) ; port Motor_2_A
NetDCL1_2: U?.18(OUT2B) ; port Motor_2_B
NetDCR1_1: U?.9(OUT1A) ; port Motor_1_A
NetDCR1_2: U?.12(OUT1B) ; port Motor_1_B
NetFreescale_Processor1_16: U?.6(IN1A) ; port DCM_1_A_PB0
NetFreescale_Processor1_17: U?.14(IN1B) ; port DCM_1_B_PB1
NetFreescale_Processor1_18: U?.7(IN2A) ; port DCM_2_A_PB2
NetFreescale_Processor1_19: U?.15(IN2B) ; port DCM_2_B_PB3
NetFreescale_Processor1_79: R48.2 ; port DCM_ENB
NetFreescale_Processor1_80: R47.2 ; port DCM_ENA

Not connected (* = marked no-connect by the designer): U? 21(TAB)

### Notes on the sheet
- Checked
- VS = Min 8v
  GND from VIN should be separate from Digital gnd
- ESE
- is the sole property of ESE. Any reproduction
- The Information Contained in this drawing
- Schematic P/N and Name
- Sheet Name
- 299 Doon Valley Drive
- Kitchener, ON N2G 4M4
- Canada
- Approved
- in part or in whole without the written
- permission of ESE is strictly prohibited.
- APPROVALS
- DATE
- Size
- Scale
- B
- NTS
- Bare PCB P/N
- Date
- Sheet
- Rev.
- Engineer
- of

### Library data of the parts
C36 C40 = CAP-X7R-5600pF-50V-±10%: CAP CER 5600pF 50v X7R 0805; MPN: C0805C562K5RACTU; PN: 399-1156-1-ND; Name: CAP-X7R-5600pF-50V-±10%; URL: http://www.digikey.ca/product-detail/en/C0805C562K5RACTU/399-1156-1-ND
C37 = Cap Polar-100uF-16V: CAP 85C 100uF ±20% 16V WX Series Aluminum Electrolytic; MPN: UWX1C101MCL1GB; Tan Theta: 0.16; Leakage Current: 16; Rated Ripple Current: 86; PN: 493-2105-1-ND; Name: Cap Polar-100uF-16V; Diameter: 6.3; URL: http://www.digikey.ca/product-detail/en/UWT1V101MCL1GS/493-2203-1-ND/590178
C38 = CAP-X7R-.1uF-100V-±10%: CAP CER .1uF 100v X7R 0805; MPN: C0805C104K1RACTU; PN: 399-3486-1-ND; Name: CAP-X7R-.1uF-100V-±10%; URL: http://www.digikey.ca/product-detail/en/C0805C104K1RACTU/399-3486-1-ND
C39 = CAP-X7R-10000pF-1000V-±5%: CAP CER 10000pF 1000v X7R 1210; MPN: C1210C103JDRACTU; PN: 399-5106-1-ND; Name: CAP-X7R-10000pF-1000V-±5%; URL: http://www.digikey.ca/product-detail/en/C1210C103JDRACTU/399-5106-1-ND
C41 = CAP-X7R-.22uF-50V-±10%: CAP CER .22uF 50v X7R 0805; MPN: C0805C224K5RACTU; PN: 399-3491-1-ND; Name: CAP-X7R-.22uF-50V-±10%; URL: http://www.digikey.ca/product-detail/en/C0805C224K5RACTU/399-3491-1-ND
D4 D5 = Diode 1N4148: High Conductance Fast Diode; PN: 1N4148WXTPMSCT-ND; URL: http://www.digikey.ca/product-detail/en/1N4148WX-TP/1N4148WXTPMSCT-ND/717312
R47 R48 = Resistor_100K: RES SMD 100K OHM 1% 1/8W 0805; MPN: CRCW0805100KFKEA; PN: 541-100KCCT-ND; Name: Resistor_100K; URL: http://www.digikey.ca/product-detail/en/CRCW0805100KFKEA/541-100KCCT-ND
Rp1 = Resistor_100R: RES SMD 100R OHM 1% 1/8W 0805; MPN: CRCW0805100RFKEA; PN: 541-100CCT-ND; Name: Resistor_100R; URL: http://www.digikey.ca/product-detail/en/CRCW0805100RFKEA/541-100CCT-ND
U? = L6225: IC MOTOR DRIVER PAR 20POWERSO; MPN: L6225PDTR; PN: 497-5345-1-ND; URL: http://www.digikey.ca/product-detail/en/L6225PDTR/497-5345-1-ND

## Sheet L293DD.SchDoc
size B
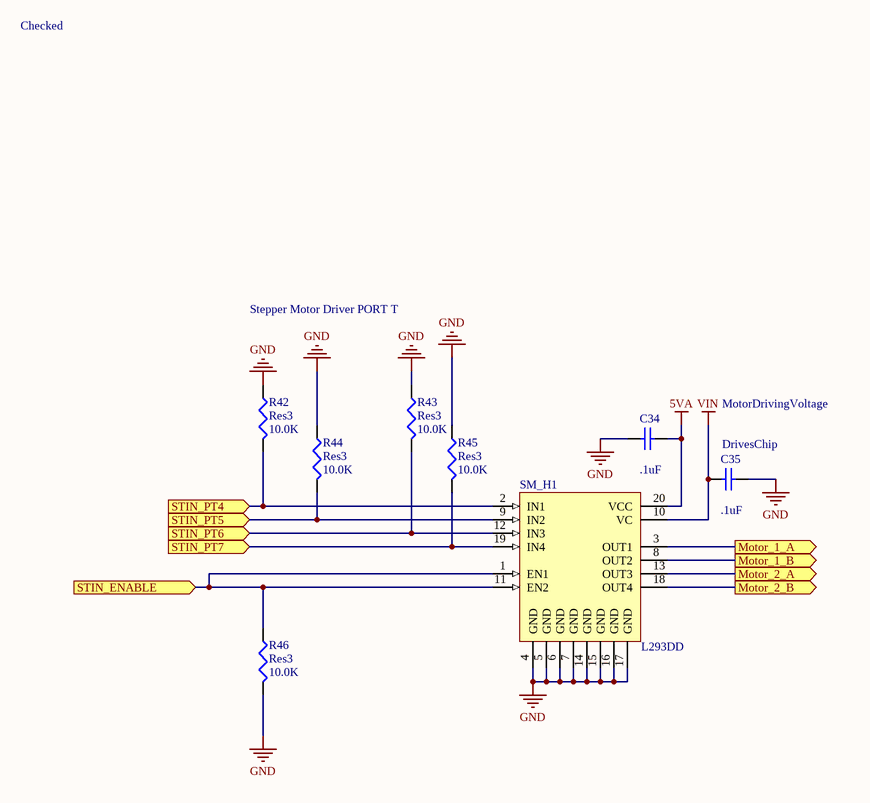
[diagram p6: L293DD.SchDoc]

### Parts
C34  value .1uF  [CAPC2012X09M]  (hidden comment: Cap)
C35  value .1uF  [CAPC2012X09M]  (hidden comment: Cap)
R42  Res3  value 10.0K  [RESC2112X05M]
R43  Res3  value 10.0K  [RESC2112X05M]
R44  Res3  value 10.0K  [RESC2112X05M]
R45  Res3  value 10.0K  [RESC2112X05M]
R46  Res3  value 10.0K  [RESC2112X05M]
SM_H1  L293DD  [SO20_N]

### Ports
Motor_1_A (out), Motor_1_B (out), Motor_2_A (out), Motor_2_B (out), STIN_ENABLE (in), STIN_PT4 (in), STIN_PT5 (in), STIN_PT6 (in), STIN_PT7 (in)

### Nets
5VA: C34.2 SM_H1.20(VCC)
GND: C34.1 C35.2 R42.1 R43.1 R44.1 R45.1 R46.2 SM_H1.4(GND) SM_H1.5(GND) SM_H1.6(GND) SM_H1.7(GND) SM_H1.14(GND) SM_H1.15(GND) SM_H1.16(GND) SM_H1.17(GND)
VIN: C35.1 SM_H1.10(VC)
Stepper A: SM_H1.3(OUT1) ; port Motor_1_A
Stepper A Bar: SM_H1.8(OUT2) ; port Motor_1_B
Stepper B: SM_H1.13(OUT3) ; port Motor_2_A
Stepper B Bar: SM_H1.18(OUT4) ; port Motor_2_B
NetFreescale_Processor1_11: R42.2 SM_H1.2(IN1) ; port STIN_PT4
NetFreescale_Processor1_12: R44.2 SM_H1.9(IN2) ; port STIN_PT5
NetFreescale_Processor1_13: R43.2 SM_H1.12(IN3) ; port STIN_PT6
NetFreescale_Processor1_14: R45.2 SM_H1.19(IN4) ; port STIN_PT7
NetFreescale_Processor1_78: R46.1 SM_H1.1(EN1) SM_H1.11(EN2) ; port STIN_ENABLE

### Notes on the sheet
- Checked
- Stepper Motor Driver PORT T
- MotorDrivingVoltage
- (near C35) DrivesChip
- ESE
- is the sole property of ESE. Any reproduction
- The Information Contained in this drawing
- Schematic P/N and Name
- Sheet Name
- 299 Doon Valley Drive
- Kitchener, ON N2G 4M4
- Canada
- Approved
- in part or in whole without the written
- permission of ESE is strictly prohibited.
- APPROVALS
- DATE
- Size
- Scale
- B
- NTS
- Bare PCB P/N
- Date
- Sheet
- Rev.
- Engineer
- of

### Library data of the parts
C34 C35 = CAP-X7R-.1uF-50V-±20%: as C26 on sheet RS232; Name: CAP-X7R-.1uF-50V-±20%; Type: X7R; URL: http://www.digikey.ca/product-detail/en/C0805C104M5RACTU/399-1169-1-ND
R42-R46 = Resistor_10.0K: as R40 on sheet Project_Board; Name: Resistor_10.0K; URL: http://www.digikey.ca/product-detail/en/CRCW080510K0FKEA/541-10.0KCCT-ND
SM_H1 = L293DD: Push-Pull Four Channel Driver With Diode; PN: 497-2937-1-ND; Published: 8-Jun-2000; LatestRevisionDate: 13-Apr-2006; LatestRevisionNote: IPC-7351 Footprint Added.; DatasheetVersion: Jun-1996; PackageVersion: Jul-2001; PackageReference: SO20; Publisher: Altium Limited; PackageDescription: 20-Pin Plastic Small Outline Integrated Circuit 1.27 mm Pitch; Code_JEDEC: MS-013-AC; Code_IPC: SOIC127P1030-20; ComponentLink1Description: Manufacturer Link; ComponentLink1URL: http://www.st.com/; ComponentLink2Description: Datasheet; ComponentLink2URL: http://www.st.com/stonline/products/literature/ds/1330/l293d.pdf; URL: http://www.digikey.ca/product-detail/en/L293DD013TR/497-2937-1-ND/634902

## Sheet RC_Servo_.SchDoc
size B
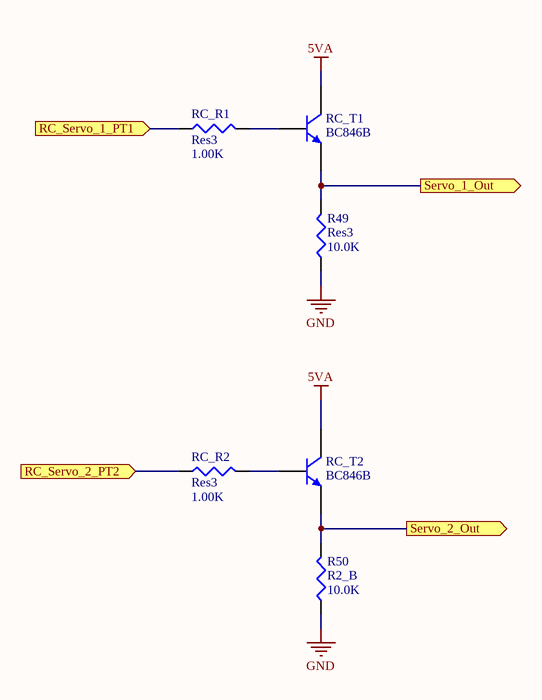
[diagram p7: RC_Servo_.SchDoc]

### Parts
R49  Res3  value 10.0K  [RESC2112X05M]
R50  R2_B  value 10.0K  [RESC2112X05M]
RC_R1  Res3  value 1.00K  [RESC2112X05M]
RC_R2  Res3  value 1.00K  [RESC2112X05M]
RC_T1  BC846B  [SOT95P230X110-3M]
RC_T2  BC846B  [SOT95P230X110-3M]

### Ports
RC_Servo_1_PT1 (in), RC_Servo_2_PT2 (in), Servo_1_Out (out), Servo_2_Out (out)

### Nets
5VA: RC_T1.3(C) RC_T2.3(C)
GND: R49.1 R50.1
Servo Signal: R49.2 RC_T1.2(E) ; port Servo_1_Out
NetFreescale_Processor1_7: RC_R1.1 ; port RC_Servo_1_PT1
NetFreescale_Processor1_8: RC_R2.1 ; port RC_Servo_2_PT2
NetR50_2: R50.2 RC_T2.2(E) ; port Servo_2_Out
NetRC_R1_2: RC_R1.2 RC_T1.1(B)
NetRC_R2_2: RC_R2.2 RC_T2.1(B)

### Notes on the sheet
- ESE
- is the sole property of ESE. Any reproduction
- The Information Contained in this drawing
- Schematic P/N and Name
- Sheet Name
- 299 Doon Valley Drive
- Kitchener, ON N2G 4M4
- Canada
- Approved
- in part or in whole without the written
- permission of ESE is strictly prohibited.
- APPROVALS
- DATE
- Size
- Scale
- B
- NTS
- Bare PCB P/N
- Date
- Sheet
- Rev.
- Checked
- Engineer
- of

### Library data of the parts
R49 R50 = Resistor_10.0K: as R40 on sheet Project_Board; Name: Resistor_10.0K; URL: http://www.digikey.ca/product-detail/en/CRCW080510K0FKEA/541-10.0KCCT-ND
RC_R1 RC_R2 = Resistor_1.00K: RES SMD 1.00K OHM 1% 1/8W 0805; MPN: CRCW08051K00FKEA; PN: 541-1.00KCCT-ND; Name: Resistor_1.00K; URL: http://www.digikey.ca/product-detail/en/CRCW08051K00FKEA/541-1.00KCCT-ND
RC_T1 RC_T2 = BC846B: as T1 on sheet RS232; URL: http://www.digikey.ca/product-detail/en/BC846B,215/568-1632-1-ND/763459

## Sheet Accelerometer_3Axis-bak.SchDoc
size B
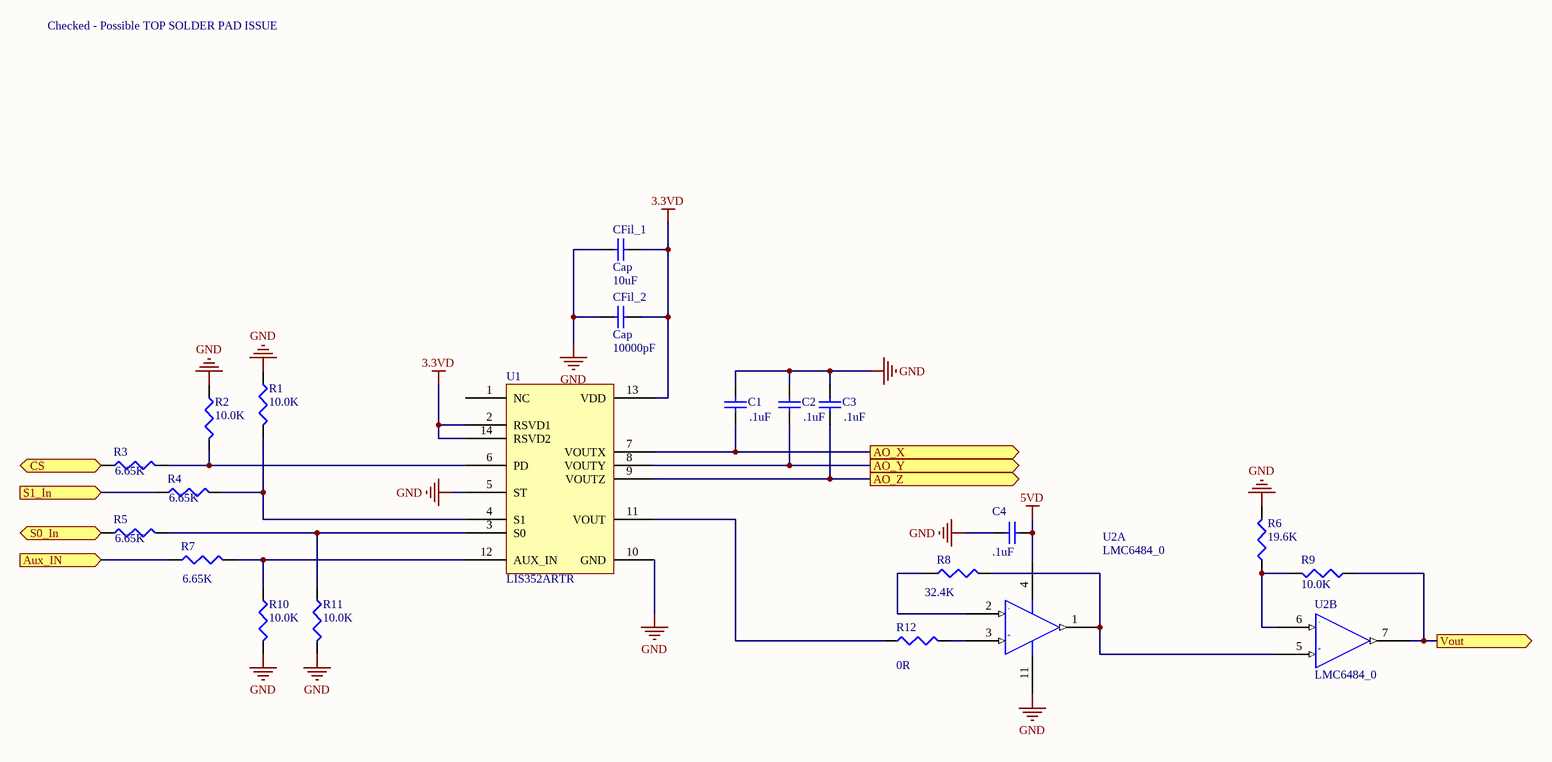
[diagram p8: Accelerometer_3Axis-bak.SchDoc]

### Parts
C1  value .1uF  [CAPC2012X09M]  (hidden comment: Cap)
C2  value .1uF  [CAPC2012X09M]  (hidden comment: Cap)
C3  value .1uF  [CAPC2012X09M]  (hidden comment: Cap)
C4  value .1uF  [CAPC2012X09M]  (hidden comment: Cap)
CFil_1  Cap  value 10uF  [CAPC2012X09M]
CFil_2  Cap  value 10000pF  [CAPC2012X09M]
R1  value 10.0K  [RESC2112X05M]  (hidden comment: Res3)
R2  value 10.0K  [RESC2112X05M]  (hidden comment: Res3)
R3  value 6.65K  [RESC2112X05M]  (hidden comment: Res3)
R4  value 6.65K  [RESC2112X05M]  (hidden comment: Res3)
R5  value 6.65K  [RESC2112X05M]  (hidden comment: Res3)
R6  value 19.6K  [RESC2112X05M]  (hidden comment: Res3)
R7  value 6.65K  [RESC2112X05M]  (hidden comment: Res3)
R8  value 32.4K  [RESC2112X05M]  (hidden comment: Res3)
R9  value 10.0K  [RESC2112X05M]  (hidden comment: Res3)
R10  value 10.0K  [RESC2112X05M]  (hidden comment: Res3)
R11  value 10.0K  [RESC2112X05M]  (hidden comment: Res3)
R12  value 0R  [RESC2112X05M]  (hidden comment: Res3)
U1  LIS352ARTR  [LGA-14-3X5MM]
U2  LMC6484_0  [SOIC127P600X175-14M-NS]  (parts A,B of 4)

### Ports
AO_X (out), AO_Y (out), AO_Z (out), Aux_IN (in), CS (in), S0_In (in), S1_In (in), Vout (out)

### Nets
3.3VD: CFil_1.1 CFil_2.1 U1.2(RSVD1) U1.13(VDD) U1.14(RSVD2)
5VD: C4.2 U2.4(VCC)
GND: C1.2 C2.2 C3.2 C4.1 CFil_1.2 CFil_2.2 R1.1 R2.1 R6.2 R10.2 R11.2 U1.5(ST) U1.10(GND) U2.11(-VCC)
AD5: R9.1 U2.7(OUT2) ; port Vout
NetACC1_2: C3.1 U1.9(VOUTZ) ; port AO_Z
NetACC1_3: C2.1 U1.8(VOUTY) ; port AO_Y
NetACC1_4: C1.1 U1.7(VOUTX) ; port AO_X
NetACC1_5: R7.1 ; port Aux_IN
NetFreescale_Processor1_2: R4.1 ; port S1_In
NetFreescale_Processor1_3: R5.1 ; port S0_In
NetFreescale_Processor1_4: R3.1 ; port CS
NetR1_2: R1.2 R4.2 U1.4(S1)
NetR2_2: R2.2 R3.2 U1.6(PD)
NetR5_2: R5.2 R11.1 U1.3(S0)
NetR6_1: R6.1 R9.2 U2.6(INVIN2)
NetR7_2: R7.2 R10.1 U1.12(AUX_IN)
NetR8_1: R8.1 U2.2(INVIN_1)
NetR8_2: R8.2 U2.1(OUT1) U2.5(NINVIN2)
NetR12_1: R12.1 U1.11(VOUT)
NetR12_2: R12.2 U2.3(NINVIN_1)

Not connected (* = marked no-connect by the designer): U1 1(NC)

### Notes on the sheet
- Checked - Possible TOP SOLDER PAD ISSUE
- ESE
- is the sole property of ESE. Any reproduction
- The Information Contained in this drawing
- Schematic P/N and Name
- Sheet Name
- 299 Doon Valley Drive
- Kitchener, ON N2G 4M4
- Canada
- Approved
- in part or in whole without the written
- permission of ESE is strictly prohibited.
- APPROVALS
- DATE
- Size
- Scale
- B
- NTS
- Bare PCB P/N
- Date
- Sheet
- Rev.
- Checked
- Engineer
- of
- (in symbol LMC6484_0, part A) -; +
- (in symbol LMC6484_0, part B) -; +

### Library data of the parts
C1-C3 = CAP-Y5V-.1uF-50V-+80%/-20%: CAP CER .1uF 50v Y5V 0805; MPN: C0805C104Z5VACTU; WV: 50; PN: 399-1177-1-ND; Name: CAP-Y5V-.1uF-50V-+80%/-20%; Tolerance: +80%/-20%; Type: Y5V; URL: http://www.digikey.ca/product-detail/en/C0805C104Z5VACTU/399-1177-1-ND
C4 = CAP-X7R-.1uF-50V-±20%: CAP CER .1uF 50v X7R 0805; MPN: C0805C104M5RACTU; PN: 399-1169-1-ND; Name: CAP-X7R-.1uF-50V-±20%; URL: http://www.digikey.ca/product-detail/en/C0805C104M5RACTU/399-1169-1-ND
CFil_1 = CAP-X5R-10uF-6.3V-±10%: CAP CER 10uF 6.3v X5R 0805; MPN: C0805C106K9PACTU; PN: 399-3138-1-ND; Name: CAP-X5R-10uF-6.3V-±10%; URL: http://www.digikey.ca/product-detail/en/C0805C106K9PACTU/399-3138-1-ND
CFil_2 = CAP-Z5U-10000pF-50V-±20%: CAP CER 10000pF 50v Z5U 0805; MPN: C0805C103M5UACTU; PN: 399-1174-1-ND; Name: CAP-Z5U-10000pF-50V-±20%; URL: http://www.digikey.ca/product-detail/en/C0805C103M5UACTU/399-1174-1-ND
R1 R2 R9-R11 = Resistor_10.0K: RES SMD 10.0K OHM 1% 1/8W 0805; MPN: CRCW080510K0FKEA; PN: 541-1000KCCT-ND; Name: Resistor_10.0K; URL: http://www.digikey.ca/product-detail/en/CRCW080510K0FKEA/541-1000KCCT-ND
R3-R5 R7 = Resistor_6.65K: RES SMD 6.65K OHM 1% 1/8W 0805; MPN: CRCW08056K65FKEA; PN: 541-6.65KCCT-ND; Name: Resistor_6.65K; URL: http://www.digikey.ca/product-detail/en/CRCW08056K65FKEA/541-6.65KCCT-ND
R6 = Resistor_19.6K: RES SMD 19.6K OHM 1% 1/8W 0805; MPN: CRCW080519K6FKEA; PN: 541-19.6KCCT-ND; Name: Resistor_19.6K; URL: http://www.digikey.ca/product-detail/en/CRCW080519K6FKEA/541-19.6KCCT-ND
R8 = Resistor_32.4K: RES SMD 32.4K OHM 1% 1/8W 0805; MPN: CRCW080532K4FKEA; PN: 541-32.4KCCT-ND; Name: Resistor_32.4K; URL: http://www.digikey.ca/product-detail/en/CRCW080532K4FKEA/541-32.4KCCT-ND
R12 = Resistor_0R_Jumper: RES SMD 0 OHM 5% 1/8W 0805; MPN: CRCW08050000Z0EA; PN: 541-0.0ACT-ND; Name: Resistor_0R_Jumper; URL: http://www.digikey.ca/product-detail/en/CRCW08050000Z0EA/541-0.0ACT-ND
U1 = LIS352AR: IC ACCELEROMETER 3AXIS LP 14LGA; PN: 497-11075-1-ND; MPN: LIS352ARTR; URL: http://www.digikey.ca/product-detail/en/LIS352ARTR/497-11075-1-ND
U2 = LMC6484_0: IC OPAMP GP 1.5MHZ RRO 14SOIC; MPN: LMC6484IMX/NOPB; PN: LMC6484IMX/NOPBCT-ND; URL: http://www.digikey.ca/product-detail/en/LMC6484IMX%2FNOPB/LMC6484IMX%2FNOPBCT-ND

## Sheet DAC_8Bit.SchDoc
size B
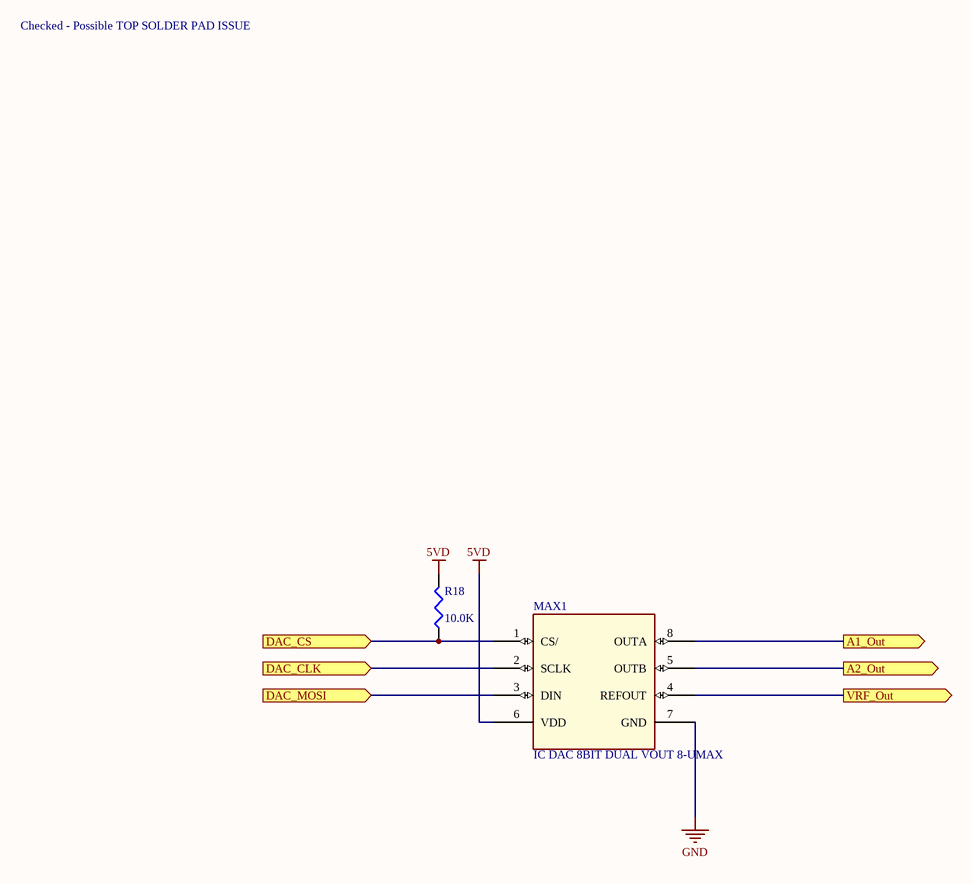
[diagram p9: DAC_8Bit.SchDoc]

### Parts
MAX1  IC DAC 8BIT DUAL VOUT 8-UMAX  [TSOP65P490X110-8M]
R18  value 10.0K  [RESC2112X05M]  (hidden comment: Res3)

### Ports
A1_Out (out), A2_Out (out), DAC_CLK (in), DAC_CS (in), DAC_MOSI (in), VRF_Out (out)

### Nets
5VD: MAX1.6(VDD) R18.2
GND: MAX1.7(GND)
DAC_CS: MAX1.1(CS/) R18.1 ; port DAC_CS
SPI_MOSI: MAX1.3(DIN) ; port DAC_MOSI
SPI_SCK: MAX1.2(SCLK) ; port DAC_CLK
NetDAC1_1: MAX1.4(REFOUT) ; port VRF_Out
NetDAC1_2: MAX1.5(OUTB) ; port A2_Out
NetDAC1_3: MAX1.8(OUTA) ; port A1_Out

### Notes on the sheet
- Checked - Possible TOP SOLDER PAD ISSUE
- ESE
- is the sole property of ESE. Any reproduction
- The Information Contained in this drawing
- Schematic P/N and Name
- Sheet Name
- 299 Doon Valley Drive
- Kitchener, ON N2G 4M4
- Canada
- Approved
- in part or in whole without the written
- permission of ESE is strictly prohibited.
- APPROVALS
- DATE
- Size
- Scale
- B
- NTS
- Bare PCB P/N
- Date
- Sheet
- Rev.
- Checked
- Engineer
- of

### Library data of the parts
MAX1 = Max5513-dac: MPN: MAX5513EUA+; PN: MAX5513EUA+-ND; URL: http://www.digikey.ca/product-detail/en/MAX5513EUA%2B/MAX5513EUA%2B-ND
R18 = Resistor_10.0K: as R40 on sheet Project_Board; Name: Resistor_10.0K; URL: http://www.digikey.ca/product-detail/en/CRCW080510K0FKEA/541-10.0KCCT-ND

## Sheet ili9327.SchDoc
size B
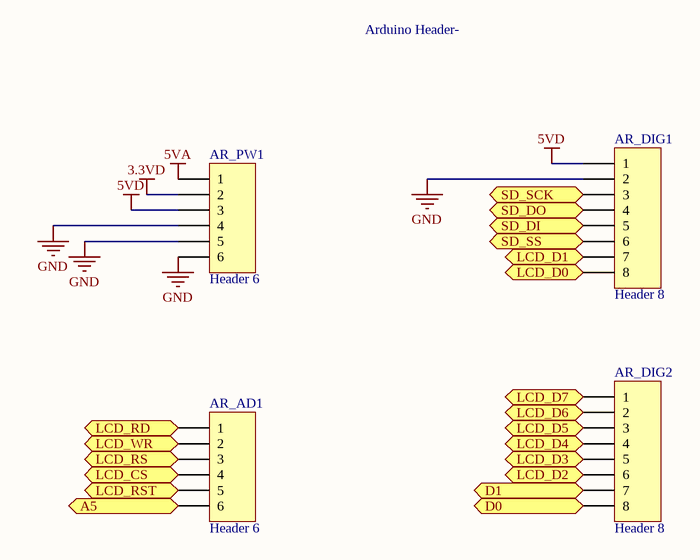
[diagram p10: ili9327.SchDoc]

### Parts
AR_AD1  Header 6  [HDR1X6]
AR_DIG1  Header 8  [HDR1X8]
AR_DIG2  Header 8  [HDR1X8]
AR_PW1  Header 6  [HDR1X6]

### Ports
A5, D0, D1, LCD_CS (in), LCD_D0, LCD_D1, LCD_D2, LCD_D3, LCD_D4, LCD_D5, LCD_D6, LCD_D7, LCD_RD (in), LCD_RS (in), LCD_RST (in), LCD_WR (in), SD_DI (in), SD_DO (in), SD_SCK (in), SD_SS (in)

### Nets
3.3VD: AR_PW1.2
5VA: AR_PW1.1
5VD: AR_DIG1.1 AR_PW1.3
GND: AR_DIG1.2 AR_PW1.4 AR_PW1.5 AR_PW1.6
AD0: AR_AD1.1 ; port LCD_RD
AD1: AR_AD1.2 ; port LCD_WR
AD2: AR_AD1.3 ; port LCD_RS
AD3: AR_AD1.4 ; port LCD_CS
AD4: AR_AD1.5 ; port LCD_RST
AD5: AR_AD1.6 ; port A5
PA0: AR_DIG1.8 ; port LCD_D0
PA1: AR_DIG1.7 ; port LCD_D1
PA2: AR_DIG2.6 ; port LCD_D2
PA3: AR_DIG2.5 ; port LCD_D3
PA4: AR_DIG2.4 ; port LCD_D4
PA5: AR_DIG2.3 ; port LCD_D5
PA6: AR_DIG2.2 ; port LCD_D6
PA7: AR_DIG2.1 ; port LCD_D7
PB6: AR_DIG2.8 ; port D0
PB7: AR_DIG2.7 ; port D1
SPI_MISO: AR_DIG1.5 ; port SD_DI
SPI_MOSI: AR_DIG1.4 ; port SD_DO
SPI_SCK: AR_DIG1.3 ; port SD_SCK
SPI_SS: AR_DIG1.6 ; port SD_SS

### Notes on the sheet
- Arduino Header-
- ESE
- is the sole property of ESE. Any reproduction
- The Information Contained in this drawing
- Schematic P/N and Name
- Sheet Name
- 299 Doon Valley Drive
- Kitchener, ON N2G 4M4
- Canada
- Approved
- in part or in whole without the written
- permission of ESE is strictly prohibited.
- APPROVALS
- DATE
- Size
- Scale
- B
- NTS
- Bare PCB P/N
- Date
- Sheet
- Rev.
- Checked
- Engineer
- of

### Library data of the parts
AR_AD1 AR_PW1 = Header 6: Header, 6-Pin; LatestRevisionDate: 17-Jul-2002; LatestRevisionNote: Re-released for DXP Platform.; Publisher: Altium Limited
AR_DIG1 AR_DIG2 = Header 8: Header, 8-Pin; LatestRevisionDate: 17-Jul-2002; LatestRevisionNote: Re-released for DXP Platform.; Publisher: Altium Limited